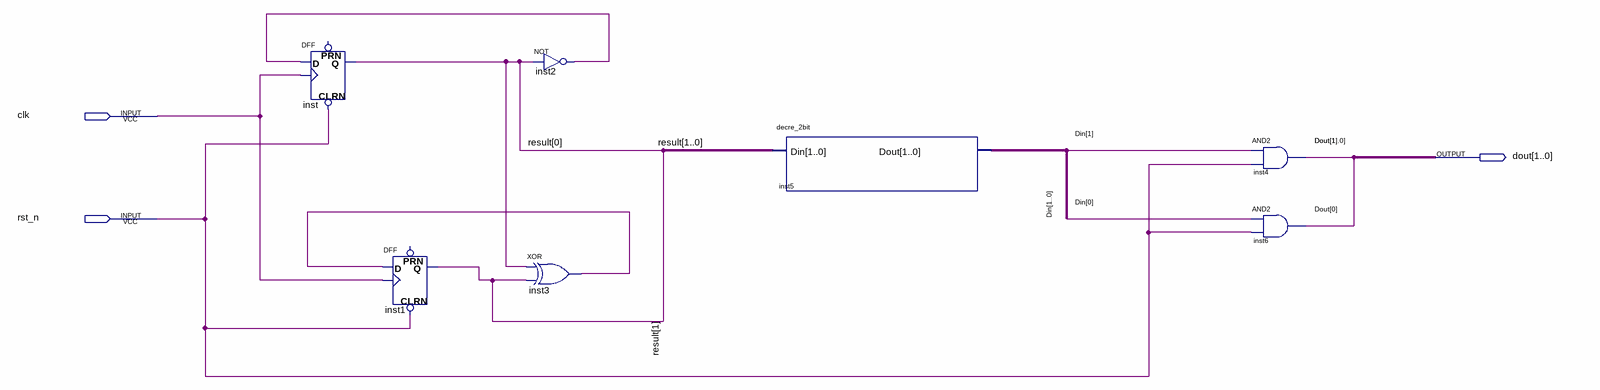
[diagram p0: schematic sheet]
// Quartus schematic counter4.bdf as structural Verilog: 7 symbols, 3 pins
module counter4 (
  input  clk,
  input  rst_n,
  output [1:0] dout
);

  wire inst2_out, inst3_out;
  wire [1:0] Din, result;

  DFF inst (.CLRN(rst_n), .CLK(clk), .D(inst2_out), .Q(result[0]));  // open: PRN
  DFF inst1 (.CLRN(rst_n), .CLK(clk), .D(inst3_out), .Q(result[1]));  // open: PRN
  not inst2 (inst2_out, result[0]);
  xor inst3 (inst3_out, result[0], result[1]);
  decre_2bit inst5 (.Din(result), .Dout(Din));
  and inst4 (dout[1], Din[1], rst_n);
  and inst6 (dout[0], Din[0], rst_n);
endmodule
